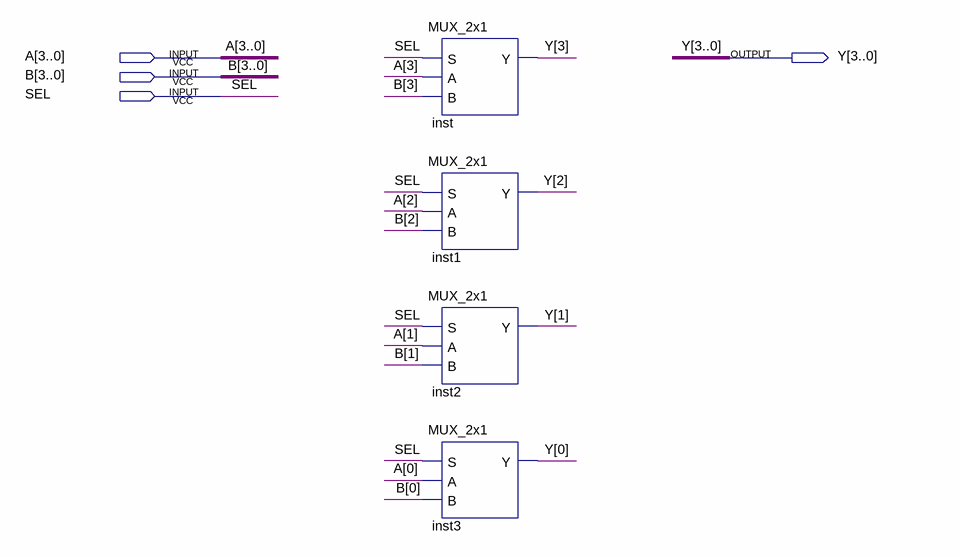
[diagram p0: schematic sheet]
// Quartus schematic MUX_2x1_4bit.bdf as structural Verilog: 4 symbols, 4 pins
module MUX_2x1_4bit (
  input  [3:0] A,
  input  [3:0] B,
  input  SEL,
  output [3:0] Y
);

  MUX_2x1 inst (.S(SEL), .A(A[3]), .B(B[3]), .Y(Y[3]));
  MUX_2x1 inst1 (.S(SEL), .A(A[2]), .B(B[2]), .Y(Y[2]));
  MUX_2x1 inst2 (.S(SEL), .A(A[1]), .B(B[1]), .Y(Y[1]));
  MUX_2x1 inst3 (.S(SEL), .A(A[0]), .B(B[0]), .Y(Y[0]));
endmodule
